# Altium schematic sheet Power.SchDoc
size A2; Organization: Altium Limited; Address1: L3, 12a Rodborough Rd; Address2: Frenchs Forest; Address3: NSW; Address4: Australia 2086
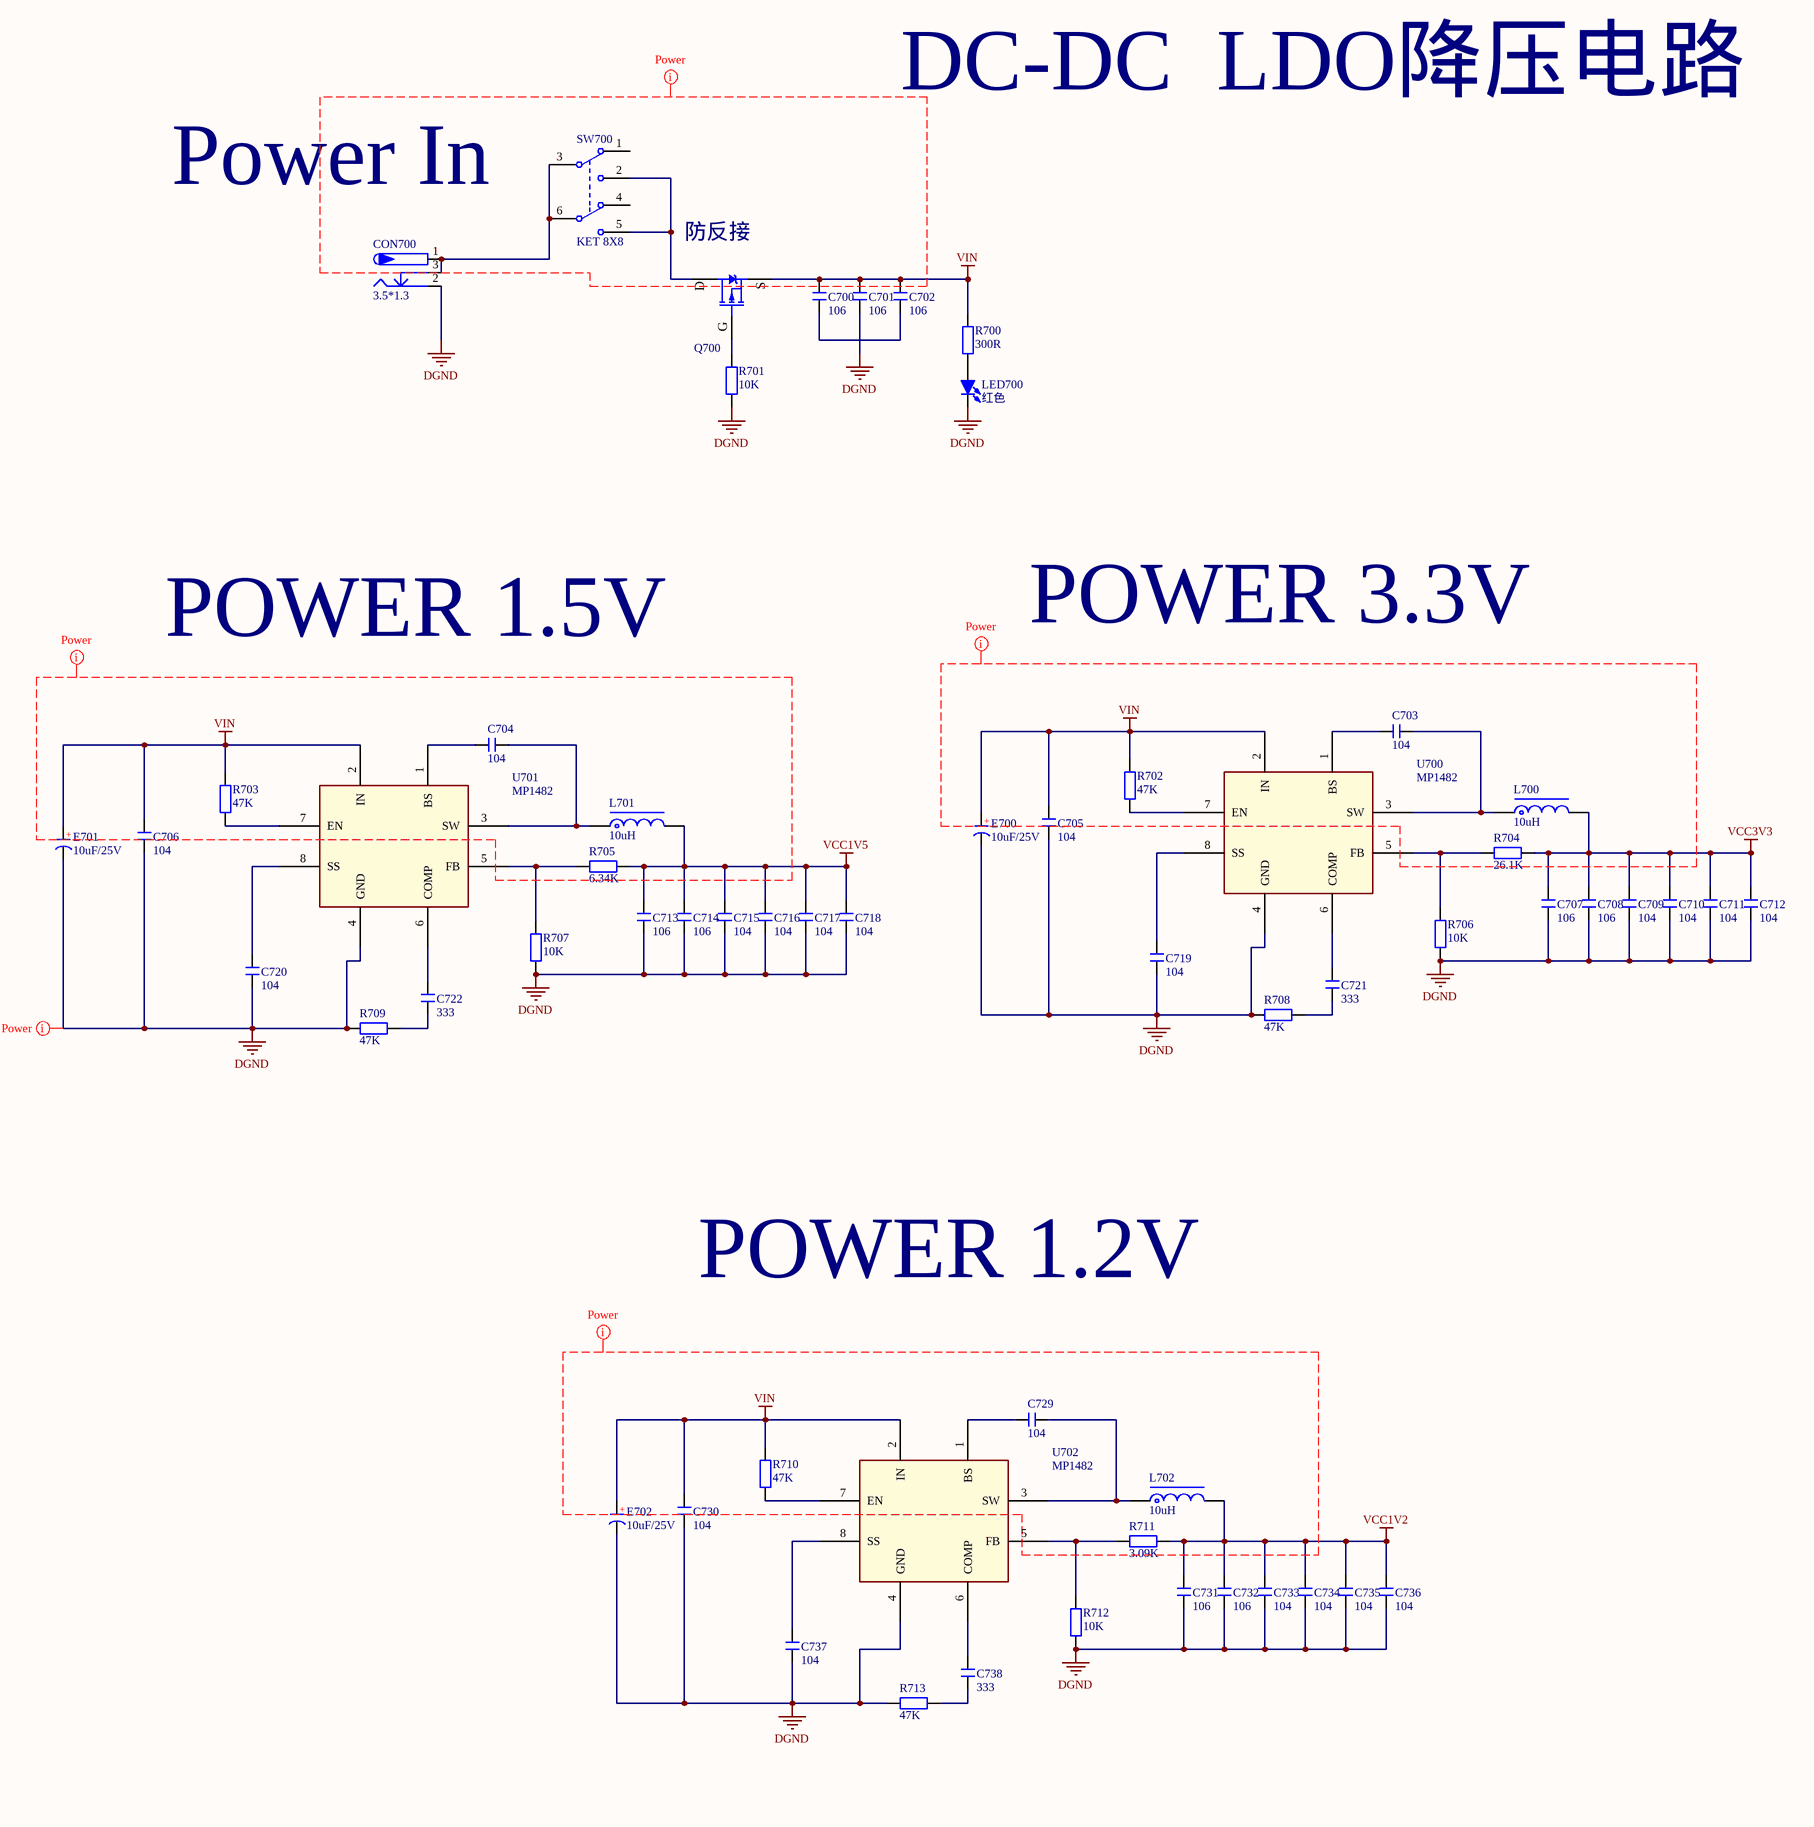
[diagram p0: Power.SchDoc, left]
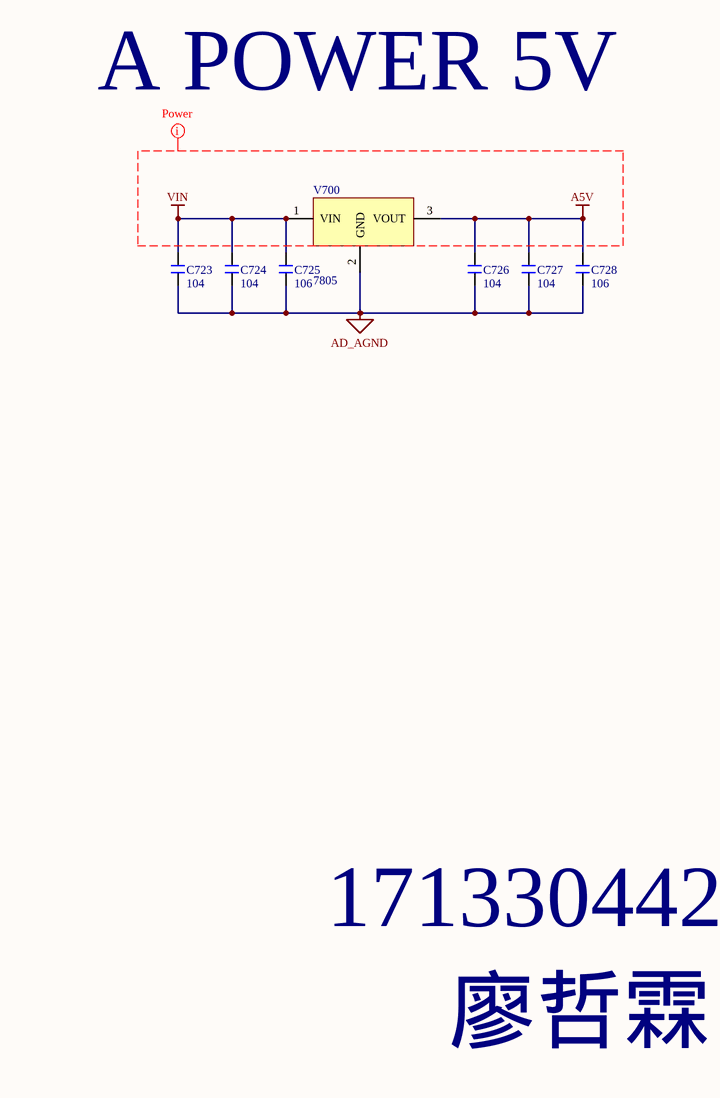
[diagram p1: Power.SchDoc, right]

## Parts
C700  106  [C 0402_M]
C701  106  [C 0402_M]
C702  106  [C 0402_M]
C703  104  [C 0402_M]
C704  104  [C 0402_M]
C705  104  [C 0402_M]
C706  104  [C 0402_M]
C707  106  [C 0402_M]
C708  106  [C 0402_M]
C709  104  [C 0402_M]
C710  104  [C 0402_M]
C711  104  [C 0402_M]
C712  104  [C 0402_M]
C713  106  [C 0402_M]
C714  106  [C 0402_M]
C715  104  [C 0402_M]
C716  104  [C 0402_M]
C717  104  [C 0402_M]
C718  104  [C 0402_M]
C719  104  [C 0402_M]
C720  104  [C 0402_M]
C721  333  [C 0402_M]
C722  333  [C 0402_M]
C723  104  [C 0402_M]
C724  104  [C 0402_M]
C725  106  [C 0402_M]
C726  104  [C 0402_M]
C727  104  [C 0402_M]
C728  106  [C 0402_M]
C729  104  [C 0402_M]
C730  104  [C 0402_M]
C731  106  [C 0402_M]
C732  106  [C 0402_M]
C733  104  [C 0402_M]
C734  104  [C 0402_M]
C735  104  [C 0402_M]
C736  104  [C 0402_M]
C737  104  [C 0402_M]
C738  333  [C 0402_M]
CON700  3.5*1.3  [DC-005]
E700  10uF/25V  [CS 2.5*6.3*11 - C]
E701  10uF/25V  [CS 2.5*6.3*11 - C]
E702  10uF/25V  [CS 2.5*6.3*11 - C]
L700  10uH  [CD43]
L701  10uH  [CD43]
L702  10uH  [CD43]
LED700  红色  [LED 0603W]
Q700  D15P05  [TO252]  (value not drawn)
R700  300R  [R 0402_M]
R701  10K  [R 0402_M]
R702  47K  [R 0402_M]
R703  47K  [R 0402_M]
R704  26.1K  [R 0402_M]
R705  6.34K  [R 0402_M]
R706  10K  [R 0402_M]
R707  10K  [R 0402_M]
R708  47K  [R 0402_M]
R709  47K  [R 0402_M]
R710  47K  [R 0402_M]
R711  3.09K  [R 0402_M]
R712  10K  [R 0402_M]
R713  47K  [R 0402_M]
SW700  KET 8X8  [KFT DIP-8X8]
U700  MP1482  [SOP8_M]
U701  MP1482  [SOP8_M]
U702  MP1482  [SOP8_M]
V700  7805  [TO252]

## Nets
A5V: C726.2 C727.2 C728.2 V700.3(VOUT)
AD_AGND: C723.1 C724.1 C725.1 C726.1 C727.1 C728.1 V700.2(GND)
DGND: C701.1 C705.1 C706.1 C707.1 C708.1 C709.1 C710.1 C711.1 C712.1 C713.1 C714.1 C715.1 C716.1 C717.1 C718.1 C719.1 C720.1 C730.1 C731.1 C732.1 C733.1 C734.1 C735.1 C736.1 C737.1 CON700.2 E700.2(K) E701.2(K) E702.2(K) LED700.2(K) R701.2 R706.2 R707.2 R708.2 R709.2 R712.2 R713.2 U700.4(GND) U701.4(GND) U702.4(GND)
VCC1V2: C731.2 C732.2 C733.2 C734.2 C735.2 C736.2 L702.2 R711.1
VCC1V5: C713.2 C714.2 C715.2 C716.2 C717.2 C718.2 L701.2 R705.1
VCC3V3: C707.2 C708.2 C709.2 C710.2 C711.2 C712.2 L700.2 R704.1
VIN: C700.2 C701.2 C702.2 C705.2 C706.2 C723.2 C724.2 C725.2 C730.2 E700.1(A) E701.1(A) E702.1(A) Q700.3(S) R700.1 R702.2 R703.2 R710.2 U700.2(IN) U701.2(IN) U702.2(IN) V700.1(VIN)
NetC700_1: C700.1 C702.1
NetC703_1: C703.1 L700.1 U700.3(SW)
NetC703_2: C703.2 U700.1(BS)
NetC704_1: C704.1 L701.1 U701.3(SW)
NetC704_2: C704.2 U701.1(BS)
NetC719_2: C719.2 U700.8(SS)
NetC720_2: C720.2 U701.8(SS)
NetC721_1: C721.1 R708.1
NetC721_2: C721.2 U700.6(COMP)
NetC722_1: C722.1 R709.1
NetC722_2: C722.2 U701.6(COMP)
NetC729_1: C729.1 L702.1 U702.3(SW)
NetC729_2: C729.2 U702.1(BS)
NetC737_2: C737.2 U702.8(SS)
NetC738_1: C738.1 R713.1
NetC738_2: C738.2 U702.6(COMP)
NetCON700_1: CON700.1 CON700.3 SW700.3(NO1) SW700.6(NC2)
NetLED700_1: LED700.1(A) R700.2
NetQ700_1: Q700.1(G) R701.1
NetQ700_2: Q700.2(D) SW700.2(COM2) SW700.5(COM2)
NetR702_1: R702.1 U700.7(EN)
NetR703_1: R703.1 U701.7(EN)
NetR704_2: R704.2 R706.1 U700.5(FB)
NetR705_2: R705.2 R707.1 U701.5(FB)
NetR710_1: R710.1 U702.7(EN)
NetR711_2: R711.2 R712.1 U702.5(FB)

Not connected (* = marked no-connect by the designer): SW700 1(NC1) 4(NO2)

## Layout directives
net class Power: (no net found under the mark), A5V, DGND, VIN

## Notes on the sheet
- DC-DC  LDO降压电路
- Power In
- (near Q700) 防反接
- POWER 1.5V
- POWER 3.3V
- A POWER 5V
- POWER 1.2V
- 1713304422
- 廖哲霖
- Title
- Size:
- Date:
- File:
- A2
- Number:
- Time:
- Revision:
- Sheet
- of
- (in symbol C-CS) +

## Library data of the parts
C700-C738 = C: 无极性贴片电容; 版权归属: 源创客; BOM名称: 无极性贴片电容; 学习资源: www.ooocke.com
CON700 = P-DC: 低压电源接口; BOM名称: DC电源接口; 版权归属: 源创客; 学习资源: www.ooocke.com
E700-E702 = C-CS: 直插固态电容; 版权归属: 源创客; BOM名称: 直插固态电容; 学习资源: www.ooocke.com
L700-L702 = L-CD: 贴片功率电感; BOM名称: 功率电感; 版权归属: 源创客; 学习资源: www.ooocke.com
LED700 = LED-SMD: 贴片LED; 版权归属: 源创客; BOM名称: 贴片LED; 学习资源: www.ooocke.com
Q700 = D15P05: P沟道场效应管; 版权归属: 源创客; BOM名称: P沟道场效应管; 学习资源: www.ooocke.com
R700-R713 = R: 贴片电阻; 版权归属: 源创客; BOM名称: 贴片电阻; 学习资源: www.ooocke.com
SW700 = KET 8X8: 8*8自锁开关; 版权归属: 源创客; BOM名称: 8*8自锁开关; 学习资源: www.ooocke.com
V700 = 78xx: 线性稳压芯片; 版权归属: 源创客; BOM名称: 线性稳压芯片; 学习资源: www.ooocke.com